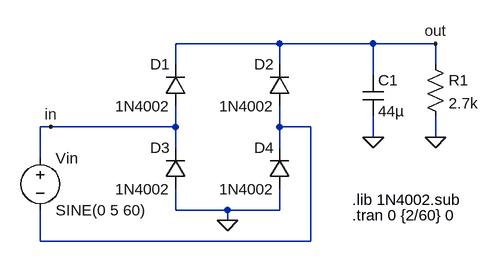
[diagram p0: schematic PreLab6.asc]
PreLab6.asc, the LTspice schematic file:
Version 4
SHEET 1 900 680
WIRE 304 272 144 272
WIRE 448 272 304 272
WIRE 544 272 448 272
WIRE 144 304 144 272
WIRE 304 304 304 272
WIRE 544 304 544 272
WIRE 448 320 448 272
WIRE -48 400 -64 400
WIRE 144 400 144 368
WIRE 144 400 -48 400
WIRE 304 400 304 368
WIRE 352 400 304 400
WIRE 448 416 448 384
WIRE 544 416 544 384
WIRE 144 432 144 400
WIRE 304 432 304 400
WIRE -64 448 -64 400
WIRE 144 528 144 496
WIRE 224 528 144 528
WIRE 304 528 304 496
WIRE 304 528 224 528
WIRE 224 544 224 528
WIRE -64 576 -64 528
WIRE 352 576 352 400
WIRE 352 576 -64 576
FLAG 544 272 out
FLAG -48 400 in
FLAG 448 416 0
FLAG 544 416 0
FLAG 224 544 0
SYMBOL voltage -64 432 R0
WINDOW 123 0 0 Left 0
WINDOW 39 0 0 Left 0
SYMATTR InstName Vin
SYMATTR Value SINE(0 5 60)
SYMBOL res 528 288 R0
SYMATTR InstName R1
SYMATTR Value 2.7k
SYMBOL cap 432 320 R0
SYMATTR InstName C1
SYMATTR Value 44µ
SYMBOL diode 160 368 R180
WINDOW 0 24 64 Left 2
WINDOW 3 24 0 Left 2
SYMATTR InstName D1
SYMATTR Value 1N4002
SYMBOL diode 320 368 R180
WINDOW 0 24 64 Left 2
WINDOW 3 24 0 Left 2
SYMATTR InstName D2
SYMATTR Value 1N4002
SYMBOL diode 160 496 R180
WINDOW 0 24 64 Left 2
WINDOW 3 24 0 Left 2
SYMATTR InstName D3
SYMATTR Value 1N4002
SYMBOL diode 320 496 R180
WINDOW 0 24 64 Left 2
WINDOW 3 24 0 Left 2
SYMATTR InstName D4
SYMATTR Value 1N4002
TEXT 416 536 Left 2 !.tran 0 {2/60} 0
TEXT 416 512 Left 2 !.lib 1N4002.sub

The netlist it stands for:
* PreLab6.asc
Vin in N001 SINE(0 5 60)
R1 out 0 2.7k
C1 out 0 44µ
D1 in out 1N4002
D2 N001 out 1N4002
D3 0 in 1N4002
D4 0 N001 1N4002
.model D D
.lib standard.dio
.tran 0 {2/60} 0
.lib 1N4002.sub
.backanno
.end